# EAGLE design led-cc-driver-mk-1 (EAGLE 6.5.0)
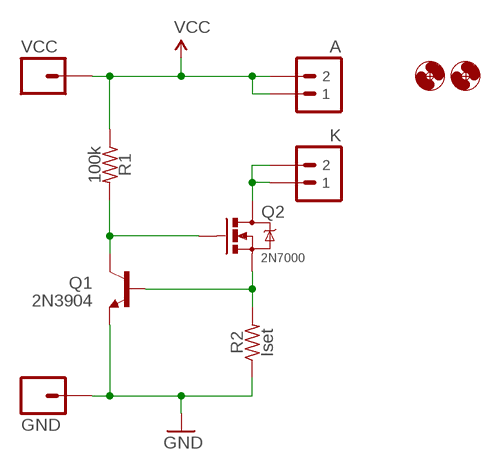
[diagram p0: schematic, sheet 1]

## Parts
A  M02PTH  [1X02]
GND  M01PTH  [1X01]
H1  HOLE#2  [HOLE-#2]
H2  HOLE#2  [HOLE-#2]
K  M02PTH  [1X02]
Q1  2N3904  TRANSISTOR_NPNTO-92-AMMO-EBC  [TO-92-AMMO]
Q2  2N7000  MOSFET-NCHANNEL2N7000-AMMO  [TO-92-AMMO]
R1  100k  RESISTORPTH-AXIAL-7.62MM  [RESISTOR-AXIAL-PTH-7.62MM]
R2  Iset  RESISTORPTH-AXIAL-7.62MM  [RESISTOR-AXIAL-PTH-7.62MM]
VCC  M01PTH  [1X01]

## Nets
GND: GND.1 Q1.1(E) R2.P$1
N$1: Q1.2(B) Q2.1(S) R2.P$2
N$2: Q1.3(C) Q2.2(G) R1.P$2
N$6: K.1 K.2 Q2.3(D)
VCC: A.1 A.2 R1.P$1 VCC.1

## Library data of the parts
A K = A_butts:M02: Standard 2-pin 0.1" header. Use with - straight break away headers ( PRT-00116) - right angle break away headers (PRT-00553) - swiss pins (PRT-00743) - machine pins (PRT-00117) - female headers (PRT-00115) Molex polarized connector foot print use with: PRT-08233 with associated crimp pins and housings. 2.54_SCREWTERM for use with PRT-10571. 3.5mm Screw Terminal footprints for PRT-08084 5mm Screw Terminal footprints for use with PRT-08433
GND VCC = A_butts:M01: Header 1 Standard 1-pin 0.1" header. Use with straight break away headers (SKU : PRT-00116), right angle break away headers (PRT-00553), swiss pins (PRT-00743), machine pins (PRT-00117), and female headers (PRT-00115).
H1 H2 = A_butts:HOLE: MOUNTING HOLE with drill center marker
Q1 = A_butts:TRANSISTOR_NPN: Generic NPN BJT MMBT2222A - TRANS-08049 (SOT-23, 1A 40V) MPSA42 - TRANS-09116 (SOT-23, 500mA 300V) MMBT5088LT1G - TRANS-11160 (SOT-23, 50 mA 30V) BC547 - COM-08928 <http://www.sparkfun.com/products/8928> (TO-92 45V 100mA) (1.Collector 2.Base 3.Emitter) 2N3904 - COM-00521 <http://www.sparkfun.com/products/521> (TO-92 40V 200mA) (1.Emitter 2.Base 3.Collector) P2N2222A - COM-12852 <http://www.sparkfun.com/products/12852> (TO-92 40V 600mA) (1.Collector 2.Base 3.Emitter)
Q2 = A_butts:MOSFET-NCHANNEL: Common NMOSFET Parts MFG P/N Store ID Prod ID FDD8780 TRANS-09984 SI7820DN TRANS-11055 FDS6630A IC-08089 2N7002PW TRANS-11151 FQP30N06L COM-10213 TRANS-10060 BSS123LT1G TRANS-08345 BSS138 TRANS-00830 BS170 2N7000
R1 R2 = A_butts:RESISTOR: RESISTOR, American symbol

## Board
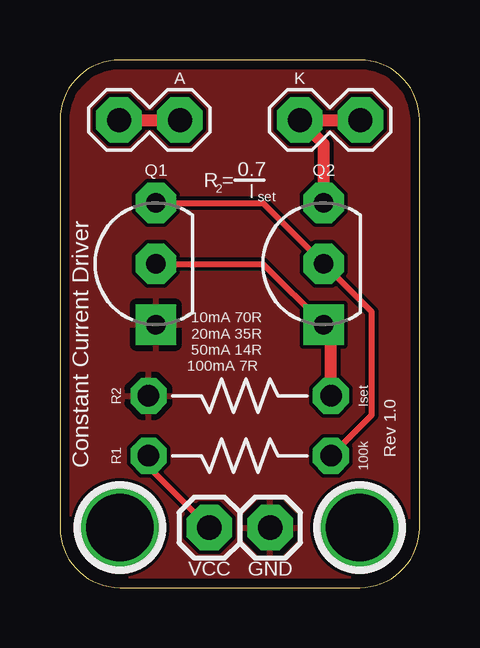
[diagram p1: board, top side]
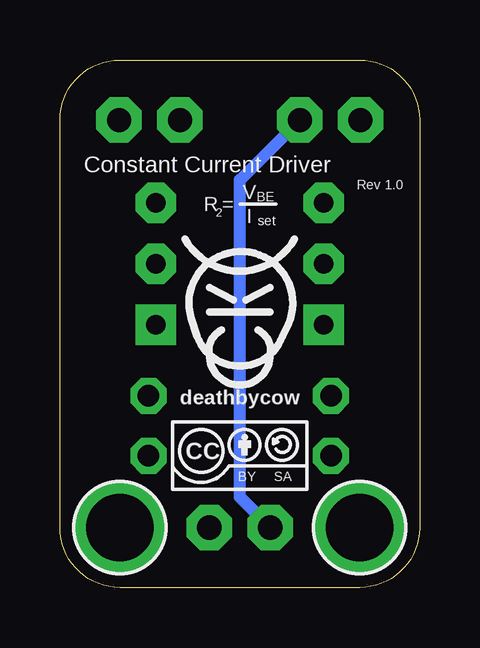
[diagram p2: board, bottom side, seen from below]

Size 15 x 22 mm. Coordinates in mm from the lower left corner, seen from the top.
Outline: 0,19.5 0,2.5 arc90 2.5,0 12.5,0 arc90 15,2.5 15,19.5 arc90 12.5,22 2.5,22 arc90 0,19.5
Copper layers (1*16): Top 0.0356mm / dielectric 1.5011mm / Bottom 0.0356mm
Design rules "LaenPCBOrder_2": minimum track width 6mil, minimum drill 13mil, track to track 6mil, track to pad 6mil, pad to pad 6mil, via to via 6mil, smd to smd 6mil, copper to edge 15mil, drill to drill 6mil, minimum pad ring 7mil, minimum via ring 7mil, stop-mask expansion 3mil, vias tented up to drill 20mil, thermal gap 10mil

### Footprints (pad centres in the part's own frame; a part is rotated, then mirrored left to right if it is on the bottom)
1X02 = drill 1 pad 1.88 octagon: 1 0,0; 2 2.54,0
1X01 = drill 1.016 pad 1.88 octagon: 1 0,0
HOLE-#2 = drill 2.8 pad 3.81: P$1 0,0
TO-92-AMMO = drill 0.813 pad 1.676 square: 1 -2.54,0 | drill 0.813 pad 1.676 octagon: 2 0,0; 3 2.54,0
RESISTOR-AXIAL-PTH-7.62MM = drill 0.9 pad 1.5 octagon: P$1 -3.81,0; P$2 3.81,0

### Placement (x,y rotation side)
A  5,19.5 180 top
GND  8.77,2.5 180 top
H1  2.5,2.5 0 top
H2  12.5,2.5 0 top
K  10,19.5 0 top
Q1  4,13.5 90 top
Q2  11,13.5 90 top
R1  7.5,5.5 0 top
R2  7.5,8 0 top
U$1  [COW_SMALL]  7.5,12 0 bottom
U$4  [CC-BY-SA-4.0-NO-URL]  7.5,5.5 0 bottom
VCC  6.23,2.5 180 top

### Tracks (layer width: path | path; a pad name or v marks a point on that pad's centre or on a via)
GND
  pour Top: 15,19.5 15,2.5 arc-90 12.5,0 2.5,0 arc-90 0,2.5 0,19.5 arc-90 2.5,22 12.5,22 arc-90
N$1
  Top 0.25: Q1.2 8.46,13.5 Q2.1
  Top 0.5: R2.P$2 11.31,10.65 Q2.1
N$2
  Top 0.25: R1.P$2 13,7.19 13,11.5 Q2.2 8.46,16.04 Q1.3
N$6
  Top 0.5: K.2 K.1 11,18.5 Q2.3
VCC
  Top 0.25: R1.P$1 3.69,5.04 VCC.1
  Top 0.5: A.2 A.1
  Bottom 0.5: A.1 7.5,17 7.5,3.77 VCC.1

### Text on the board
tPlace: R | 2 | = | 0.7 / I | set | 10mA 70R / 20mA 35R / 50mA 14R / 100mA 7R | Rev 1.0 | Constant Current Driver
bPlace: Constant Current Driver | Rev 1.0 | set | BE | I | V | = | 2 | R